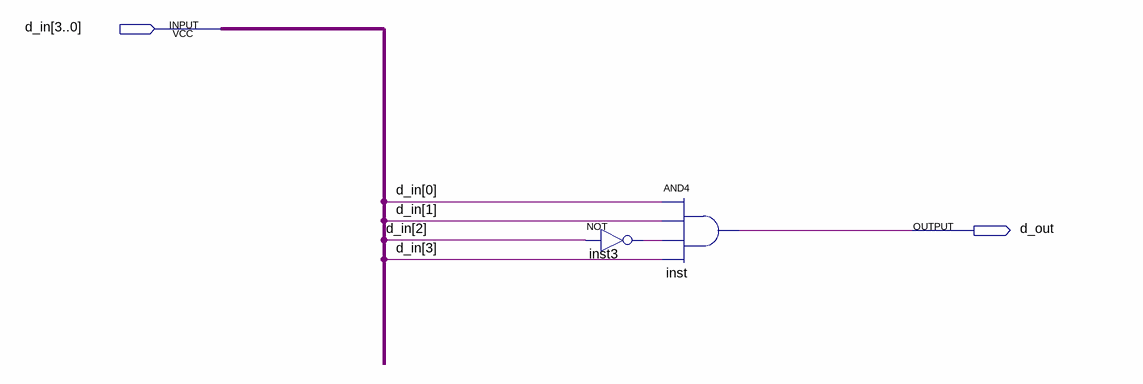
[diagram p0: schematic sheet]
// Quartus schematic check_sharp.bdf as structural Verilog: 2 symbols, 2 pins
module check_sharp (
  input  [3:0] d_in,
  output d_out
);

  wire inst3_out;

  not inst3 (inst3_out, d_in[2]);
  and inst (d_out, d_in[0], d_in[1], inst3_out, d_in[3]);
endmodule
